# EAGLE schematic smokoino (EAGLE 7.5.0)
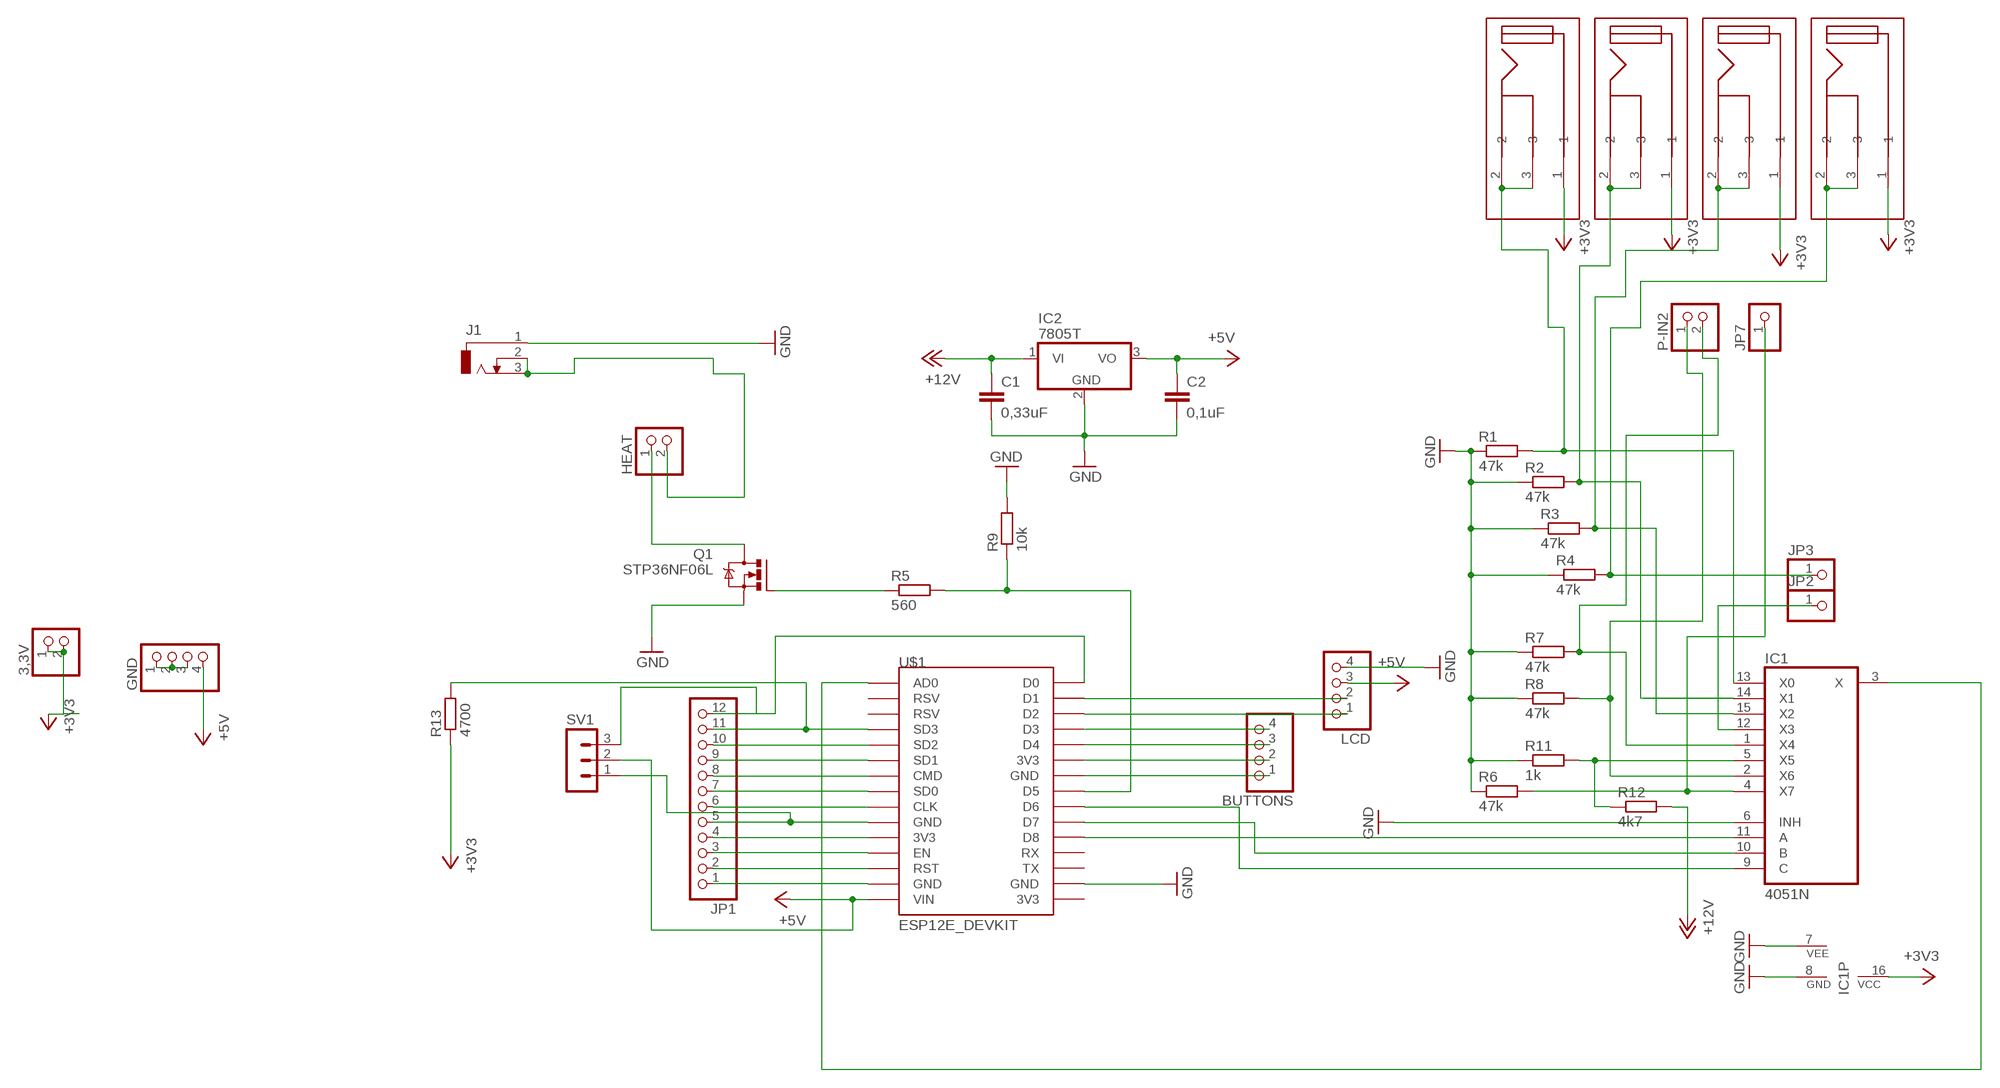
[diagram p0: schematic, sheet 1]

## Parts
3,3V  PINHD-1X2  [1X02]
BUTTONS  PINHD-1X4  [1X04]
C1  0,33uF  C5/2.5  [C5B2.5]
C2  0,1uF  C5/2.5  [C5B2.5]
GND  PINHD-1X4  [1X04]
HEAT  PINHD-1X2  [1X02]
IC1  4051N  [DIL16]
IC2  7805T  [TO220H]
J1  DCJ0303  [DCJ0303]
JP1  PINHD-1X12  [1X12]
JP2  PINHD-1X1  [1X01]
JP3  PINHD-1X1  [1X01]
JP7  PINHD-1X1  [1X01]
LCD  PINHD-1X4  [1X04]
P-IN2  PINHD-1X2  [1X02]
Q1  STP36NF06L  IRF540  [TO220BV]
R1  47k  R-EU_0207/10  [0207/10]
R2  47k  R-EU_0207/10  [0207/10]
R3  47k  R-EU_0207/10  [0207/10]
R4  47k  R-EU_0207/10  [0207/10]
R5  560  R-EU_0207/10  [0207/10]
R6  47k  R-EU_0207/10  [0207/10]
R7  47k  R-EU_0207/10  [0207/10]
R8  47k  R-EU_0207/10  [0207/10]
R9  10k  R-EU_0207/10  [0207/10]
R11  1k  R-EU_0207/10  [0207/10]
R12  4k7  R-EU_0207/10  [0207/10]
R13  4700  R-EU_0207/10  [0207/10]
SV1  MA03-1  [MA03-1]
U$1  ESP12E_DEVKIT  [ESP12E_DEVKIT]
U$3  JACK_2_5  [JACK_2_5]
U$4  JACK_2_5  [JACK_2_5]
U$5  JACK_2_5  [JACK_2_5]
U$6  JACK_2_5  [JACK_2_5]

## Nets
4051: IC1.4(X7) JP7.1 R6.2
+3V3: 3,3V.1 3,3V.2 IC1.16(VCC) JP1.4 R13.1 U$1.3V3@0(3V3) U$3.1 U$4.1 U$5.1 U$6.1
+5V: C2.1 GND.4 IC2.3(VO) LCD.3 SV1.2 U$1.VIN
+12V: C1.1 HEAT.2 IC2.1(VI) J1.2 J1.3 R12.2
GND: BUTTONS.1 C1.2 C2.2 GND.1 GND.2 GND.3 IC1.6(INH) IC1.7(VEE) IC1.8(GND) IC2.2(GND) J1.1 JP1.1 JP1.5 LCD.4 Q1.S R1.1 R2.1 R3.1 R4.1 R6.1 R7.1 R8.1 R9.2 R11.1 SV1.1 U$1.GND@0(GND) U$1.GND@1(GND) U$1.GND@2(GND) U$1.GND@3(GND)
N$1: IC1.9(C) U$1.D6
N$2: IC1.10(B) U$1.D7
N$3: IC1.11(A) U$1.D8
N$4: IC1.3(X) U$1.AD0
N$5: IC1.13(X0) R1.2 U$3.2 U$3.3
N$6: IC1.14(X1) R2.2 U$4.2 U$4.3
N$7: BUTTONS.4 U$1.D3
N$8: BUTTONS.3 U$1.D4
N$9: LCD.1 U$1.D2
N$10: LCD.2 U$1.D1
N$11: IC1.15(X2) R3.2 U$5.2 U$5.3
N$12: IC1.5(X5) R11.2 R12.1
N$13: JP1.10 U$1.SD2
N$14: IC1.12(X3) JP2.1
N$16: IC1.2(X6) P-IN2.1 R8.2
N$17: R5.2 R9.1 U$1.D5
N$18: JP1.2 U$1.RST
N$19: JP1.3 U$1.EN
N$20: BUTTONS.2 U$1.3V3@1(3V3)
N$22: JP1.6 U$1.CLK
N$23: JP1.7 U$1.SD0
N$24: JP1.8 U$1.CMD
N$25: JP1.9 U$1.SD1
N$26: Q1.G R5.1
N$27: JP1.11 R13.2 U$1.SD3
N$28: JP1.12 SV1.3 U$1.D0
N$30: IC1.1(X4) P-IN2.2 R7.2
N$40: JP3.1 R4.2 U$6.2 U$6.3
STP36NF06L: HEAT.1 Q1.D
Unconnected: U$1.3V3@2(3V3) U$1.RSV@0(RSV) U$1.RSV@1(RSV) U$1.RX U$1.TX

## Library data of the parts
3,3V HEAT P-IN2 = pinhead:PINHD-1X2: PIN HEADER
BUTTONS GND LCD = pinhead:PINHD-1X4: PIN HEADER
C1 C2 = capacitor-wima:C: CAPACITOR naming: grid - package width
IC1 = 40xx:4051: 8-channel ANALOG MULTIPLEXER
IC2 = linear:78*: Positive VOLTAGE REGULATOR Source: http://cache.national.com/ds/LM/LM78L05.pdf http://www.fairchildsemi.com/ds/LM/LM7805.pdf
J1 = con-jack:DCJ0303: DC POWER JACK Source: DCJ0303.pdf; OC_FARNELL: unknown; OC_NEWARK: unknown
JP1 = pinhead:PINHD-1X12: PIN HEADER
JP2 JP3 JP7 = pinhead:PINHD-1X1: PIN HEADER
Q1 = transistor-power:IRF540: HEXFET Power MOSFET
R1-R9 R11-R13 = rcl:R-EU_: RESISTOR, European symbol
SV1 = con-lstb:MA03-1: PIN HEADER; OC_FARNELL: unknown; OC_NEWARK: unknown
U$1 = ESP12E_DEVKIT:ESP12E_DEVKIT: ESP12E DEVKIT BOARD
U$3-U$6 = 2_5mm_jack:JACK_2_5